# Altium project EEM_PWR_MOD_AC.PrjPCB
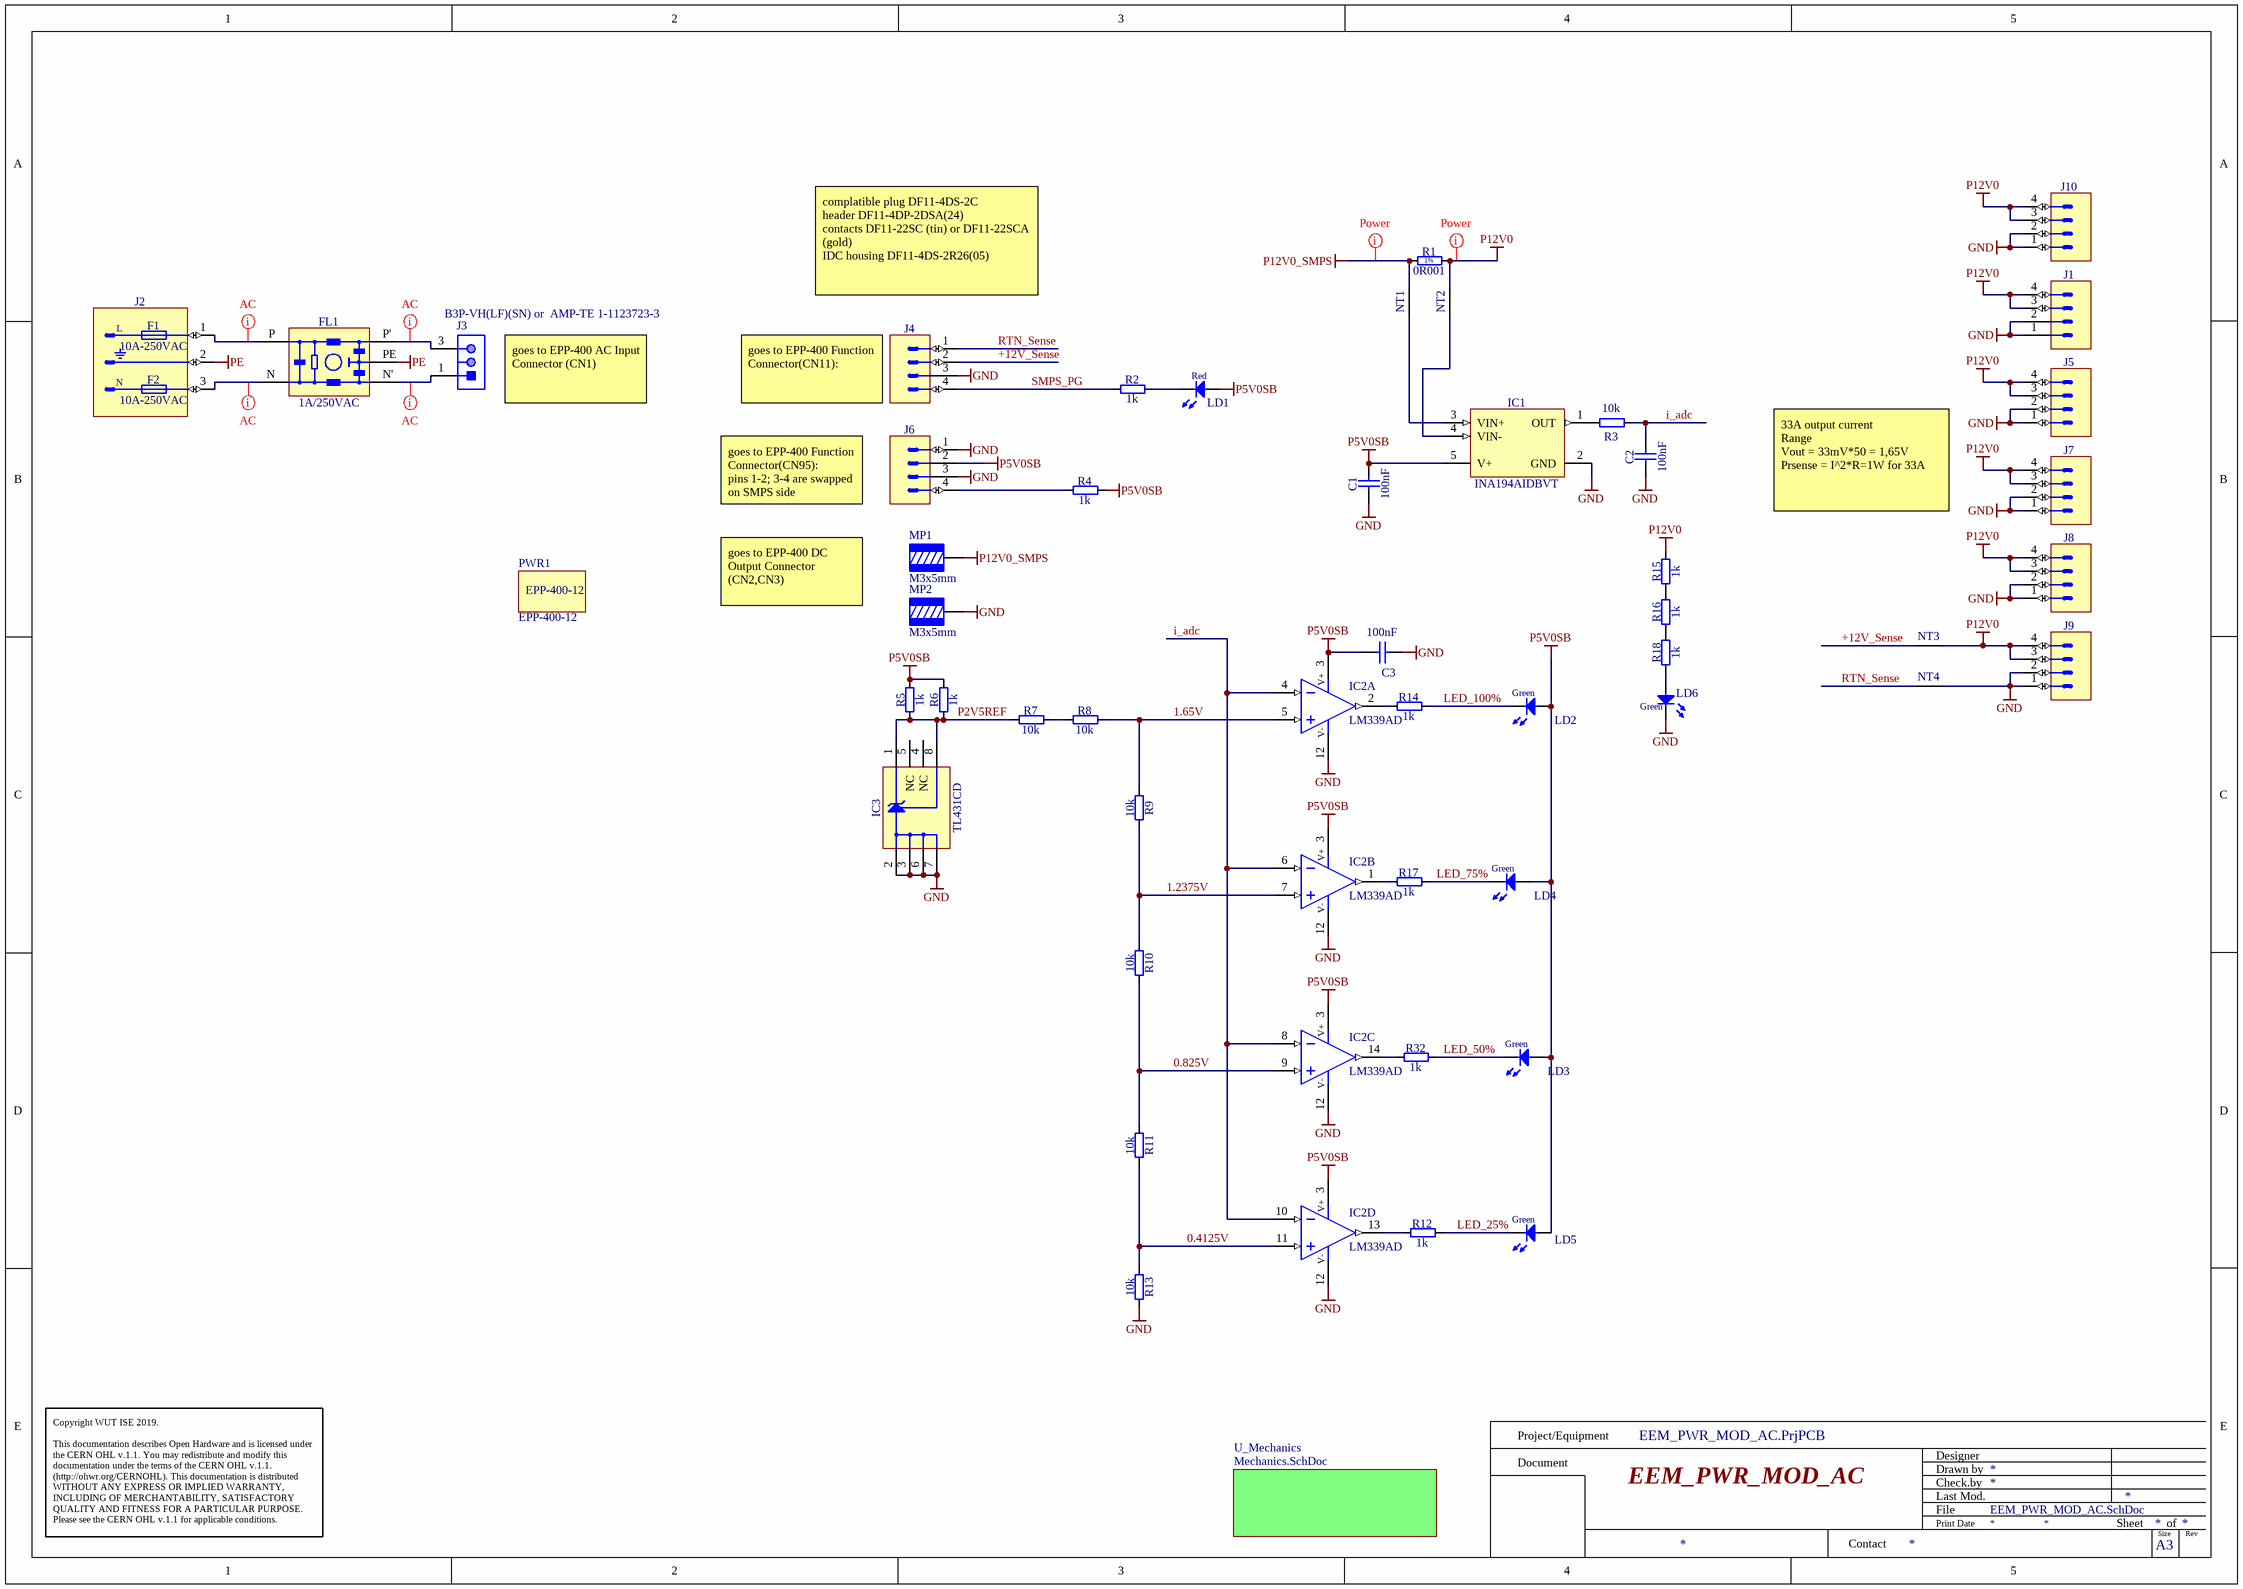
[diagram p0: EEM_PWR_MOD_AC.SchDoc]
P_version: 1.3
2 sheets, 80 parts. Net scope: global (net labels, ports and power ports of the same name join across sheets).
Board file: EEM_PWR_MOD_AC.pcbdoc
Sheets:
  EEM_PWR_MOD_AC.SchDoc
    U_Mechanics = Mechanics.SchDoc

## Sheet EEM_PWR_MOD_AC.SchDoc: EEM_PWR_MOD_AC
size 420 x 297 mm; Revision: 1.3; Title2: 1.3

### Parts
C1  100nF  [CAPC1005X55N]
C2  100nF  [CAPC1005X55N]
C3  100nF  [CAPC1005X55N]
F1  10A-250VAC  [FUSE_5X20_GLASS_v]
F2  10A-250VAC  [FUSE_5X20_GLASS_v]
FL1  1A/250VAC  [FIL_SCHAFFNER_FN 406]
IC1  INA194AIDBVT  [SOT95P280X145-5N]
IC2  LM339AD  [SOIC127P600X175-14N]  (parts A,B,C,D of 4)
IC3  TL431CD  [SOIC127P600X175-8N]
J1  Mini-Fit Jr.™  [MOLEX_39-30-0040]  (value not drawn)
J2  IEC  [SCHURTER_GSF1.2202.31]  (value not drawn)
J3  B3P-VH(LF)(SN) or  AMP-TE 1-1123723-3  [JST-B3P-VH(LF)(SN)-3_V]
J4  Header 4  [HIROSE_DF11-4DP-2DSA]  (value not drawn)
J5  Mini-Fit Jr.™  [MOLEX_39-30-0040]  (value not drawn)
J6  Header 4  [HIROSE_DF11-4DP-2DSA]  (value not drawn)
J7  Mini-Fit Jr.™  [MOLEX_39-30-0040]  (value not drawn)
J8  Mini-Fit Jr.™  [MOLEX_39-30-0040]  (value not drawn)
J9  Mini-Fit Jr.™  [MOLEX_39-30-0040]  (value not drawn)
J10  Mini-Fit Jr.™  [MOLEX_39-30-0040]  (value not drawn)
LD1  Red  [LED_AVAGO_HSMC-C120]
LD2  Green  [LED_AVAGO_HSME-C120]
LD3  Green  [LED_AVAGO_HSME-C120]
LD4  Green  [LED_AVAGO_HSME-C120]
LD5  Green  [LED_AVAGO_HSME-C120]
LD6  Green  [LED_AVAGO_HSME-C120]
MP1  M3x5mm  [7461057_for chemical surfaces]
MP2  M3x5mm  [7461057_for chemical surfaces]
NT1  Net Tie  [Net Tie]  (value not drawn)  (net tie, no BOM)
NT2  Net Tie  [Net Tie]  (value not drawn)  (net tie, no BOM)
NT3  Net Tie  [Net Tie]  (value not drawn)  (net tie, no BOM)
NT4  Net Tie  [Net Tie]  (value not drawn)  (net tie, no BOM)
PWR1  EPP-400-12  [EPP-400-12]
R1  0R001  [RESM11670X254N]
R2  1k  [RESC1608X55N]
R3  10k  [RESC1608X55N]
R4  1k  [RESC1608X55N]
R5  1k  [RESC1608X55N]
R6  1k  [RESC1608X55N]
R7  10k  [RESC1608X55N]
R8  10k  [RESC1608X55N]
R9  10k  [RESC1608X55N]
R10  10k  [RESC1608X55N]
R11  10k  [RESC1608X55N]
R12  1k  [RESC1608X55N]
R13  10k  [RESC1608X55N]
R14  1k  [RESC1608X55N]
R15  1k  [RESC1608X55N]
R16  1k  [RESC1608X55N]
R17  1k  [RESC1608X55N]
R18  1k  [RESC1608X55N]
R32  1k  [RESC1608X55N]

### Sub-sheets
U_Mechanics = Mechanics.SchDoc: no entries

### Nets
GND: C1.1 C2.1 C3.1 IC1.2(GND) IC2.12(V-) IC3.2(A) IC3.3(A) IC3.6(A) IC3.7(A) J1.1 J1.2 J4.3 J5.1 J5.2 J6.1 J6.3 J7.1 J7.2 J8.1 J8.2 J9.1 J9.2 J10.1 J10.2 LD6.1(C) MP2.1 NT4.2 R13.2
P5V0SB: C1.2 C3.2 IC1.5(V+) IC2.3(V+) J6.2 LD1.2(A) LD2.2(A) LD3.2(A) LD4.2(A) LD5.2(A) R4.2 R5.2 R6.2
P12V0: J1.3 J1.4 J5.3 J5.4 J7.3 J7.4 J8.3 J8.4 J9.3 J9.4 J10.3 J10.4 NT2.2 NT3.2 R1.2 R15.2
P12V0_SMPS: MP1.1 NT1.2 R1.1
PE: FL1.PE J2.2
0.825V: IC2.9(IN+) R10.2 R11.1
0.4125V: IC2.11(IN+) R11.2 R13.1
1.65V: IC2.5(IN+) R8.2 R9.1
1.2375V: IC2.7(IN+) R9.2 R10.1
+12V_Sense: J4.2 NT3.1
i_adc: C2.2 IC2.4(IN-) IC2.6(IN-) IC2.8(IN-) IC2.10(IN-) R3.1
LED_25%: LD5.1(C) R12.2
LED_50%: LD3.1(C) R32.2
LED_75%: LD4.1(C) R17.2
LED_100%: LD2.1(C) R14.2
P2V5REF: IC3.1(C) IC3.8(REF) R5.1 R6.1 R7.1
RTN_Sense: J4.1 NT4.1
SMPS_PG: J4.4 R2.1
NetFL1_N: FL1.N J2.3
NetFL1_N': FL1.N' J3.1
NetFL1_P: FL1.P J2.1
NetFL1_P': FL1.P' J3.3
NetIC1_1: IC1.1(OUT) R3.2
NetIC1_3: IC1.3(VIN+) NT1.1
NetIC1_4: IC1.4(VIN-) NT2.1
NetIC2_1: IC2.1(OUT) R17.1
NetIC2_2: IC2.2(OUT) R14.1
NetIC2_13: IC2.13(OUT) R12.1
NetIC2_14: IC2.14(OUT) R32.1
NetJ6_4: J6.4 R4.1
NetLD1_1: LD1.1(C) R2.2
NetLD6_2: LD6.2(A) R18.1
NetR7_2: R7.2 R8.1
NetR15_1: R15.1 R16.2
NetR16_1: R16.1 R18.2

Not connected (* = marked no-connect by the designer): IC3 4(NC) 5(NC)

### Layout directives
net class AC: NetFL1_N, NetFL1_N', NetFL1_P, NetFL1_P'
net class Power: P12V0, P12V0_SMPS

### Notes on the sheet
- complatible plug DF11-4DS-2C
  header DF11-4DP-2DSA(24)
  contacts DF11-22SC (tin) or DF11-22SCA (gold)
  IDC housing DF11-4DS-2R26(05)
- (near J3) goes to EPP-400 AC Input Connector (CN1)
- goes to EPP-400 Function Connector(CN11):
- goes to EPP-400 Function Connector(CN95):
  pins 1-2; 3-4 are swapped on SMPS side
- 33A output current
  Range
  Vout = 33mV*50 = 1,65V
  Prsense = I^2*R=1W for 33A
- goes to EPP-400 DC Output Connector (CN2,CN3)
- Project/Equipment
- Document
- Designer
- Drawn by
- Check.by
- Copyright WUT ISE 2019.
  This documentation describes Open Hardware and is licensed under the CERN OHL v.1.1. You may redistribute and modify this documentation under the terms of the CERN OHL v.1.1. (http://ohwr.org/CERNOHL). This documentation is distributed WITHOUT ANY EXPRESS OR IMPLIED WARRANTY, INCLUDING OF MERCHANTABILITY, SATISFACTORY QUALITY AND FITNESS FOR A PARTICULAR PURPOSE. Please see the CERN OHL v.1.1 for applicable conditions.
- Contact
- File
- Last Mod.
- Print Date
- Sheet
- Size
- A3
- of
- Rev
- (in symbol R4527_0R001_1%_2W_75PPM) 1%
- (in symbol SCHURTER_GSF1.2202.31) L; N

### Library data of the parts
C1-C3 = CC0402_100NF_25V_10%_X7R_YUDEN_TMK105B7104KVHF: Non-polarised capacitor; Part Description: SMD Multilayer Chip Ceramic Capacitor (High Dielectric Type) for Automotive / Industrial Applications; Manufacturer: TAIYO YUDEN; Voltage: 25V; TC: X7R; Tolerance: ±10%; Part Number: CC0402_100NF_25V_10%_X7R_YUDEN_TMK105B7104KVHF; Component Kind: Standard; Component Type: Standard; Pin Count: 2; Value: 100nF; Status: Not Recommended; Manufacturer Part Number: TMK105B7104KVHF; Case: 0402; Mounted: Yes; Socket: No; SMD: Yes; Sense: No; HelpURL: \\cern.ch\dfs\Applications\Altium\Datasheets\CC0402_TAIYO-YUDEN_TMK105B7104KVHF.pdf; Author: CERN DEM JLC; CreateDate: 10/05/2017; LatestRevisionDate: 10/05/2017; ComponentHeight: 0.55mm
F1 F2 = FUSE_SCHURTER_0034.3127_v: Fuse; Part Description: Cylindrical 5x20 mm, Time-Lag T Miniature Fuse, FST Series; PressFit: No; Part Number: FUSE_SCHURTER_0034.3127_v; Component Kind: Accessories; Component Type: Standard; Pin Count: 0; PackageDescription: 5x20mm Cylindrical Fuse, SCHURTER FST5X20 Series; Family: Fuse; Mounted: Yes; Socket: Yes; SMD: No; Sense: No; Value: 10A-250VAC; Manufacturer: SCHURTER; Manufacturer Part Number: 0034.3127; ComponentHeight: 20.5mm; HelpURL: \\cern.ch\dfs\Applications\Altium\Datasheets\FUSE_SCHURTER_FST5X20.pdf; Author: CERN DEM JLC; CreateDate: 28.01.2013; LatestRevisionDate: 28.01.2013; ClassName: Overlapping
FL1 = FIL_SCHAFFNER_FN 406-1-02: 0.6 to 8.4A 230VAC Single Phase Ultra Compact EMC Filter; Part Number: FIL_SCHAFFNER_FN406-3-02; Manufacturer Part Number: FN406-3-02; Component Kind: Standard; Component Type: Standard; Pin Count: 5; Value: 1A/250VAC; Part Description: Single Phase Ultra Compact EMC Filter; Manufacturer: SCHAFFNER; Case: L45 W15 H28; Mounted: Yes; Socket: No; SMD: No; Sense: No; ComponentHeight: 28mm; HelpURL: \\cern.ch\dfs\Applications\Altium\Datasheets\FIL_SCHAFFNER_FN 406-1-02.pdf; Author: CERN DEM JLC; CreateDate: 24.05.2017; LatestRevisionDate: 24.05.2017
IC1 = INA194AIDBVT: Current Shunt Monitor -16V to +80V Common-Mode Range; Manufacturer: TEXAS INSTRUMENTS; PressFit: No; Bonding: No; Part Number: INA194AIDBVT; Component Kind: Standard; Component Type: Standard; Device: INA194AIDBVT; PackageDescription: SOT, 0.95mm pitch; 5 pin, 1.60mm W X 2.90mm L X 1.45mm H body, IPC Medium Density; Part Description: Current Shunt Monitor -16V to +80V Common-Mode Range; Manufacturer Part Number: INA194AIDBVT; Pin Count: 5; Case: SOT23-5; Mounted: Yes; Socket: No; SMD: Yes; Sense: No; ComponentHeight: 1.45mm; Author: CERN DEM JLC; HelpURL: \\cern.ch\dfs\Applications\Altium\Datasheets\INA194AIDBVT.pdf; CreateDate: 10.05.2010; LatestRevisionDate: 10.05.2010
IC2 = LM339AD: Quad Operational Amplifier; Part Description: Quad Differential Comparator; Manufacturer: TEXAS INSTRUMENTS; PressFit: No; Bonding: No; Part Number: LM339AD; Component Kind: Standard; Component Type: Standard; Device: LM339AD; PackageDescription: SOIC 14, Pitch 1.27mm - Body 4x8.75mm, IPC Medium Density; Manufacturer Part Number: LM339AD; Pin Count: 14; Case: SOIC14; Mounted: Yes; Socket: No; SMD: Yes; Sense: No; ComponentHeight: 1.75mm; Author: CERN DEM JLC; HelpURL: \\cern.ch\dfs\Applications\Altium\Datasheets\LM339AD.pdf; CreateDate: 09.03.2011; LatestRevisionDate: 09.03.2011
IC3 = TL431CD: Precision Programmable Reference; Part Description: Vref (2.5V) To 36V 2% Precision Programmable Reference; Manufacturer: TEXAS INSTRUMENTS; PressFit: No; Bonding: No; Part Number: TL431CD; Component Kind: Standard; Component Type: Standard; Device: TL431CD; PackageDescription: SOIC 8, Pitch 1.27mm, Body 4x5mm, IPC Medium Density; Manufacturer Part Number: TL431CD; Pin Count: 8; Case: SOIC8; Mounted: Yes; Socket: No; SMD: Yes; Sense: No; ComponentHeight: 1.75mm; HelpURL: \\cern.ch\dfs\Applications\Altium\Datasheets\TL431CD.pdf; Author: CERN DEM JLC; CreateDate: 18.01.2011; LatestRevisionDate: 28.02.2011
J1 J5 J7-J10 = MOLEX_39-30-0040: Connector 4 Male; Part Description: 4.20mm (.165") Pitch Mini-Fit Jr. Header, Dual Row, Right Angle with Snap-in Plastic Peg PCB Lock, 4 Circuits; Manufacturer: MOLEX; PressFit: No; Part Number: MOLEX_39-30-0040; Component Kind: Standard; Component Type: Standard; Pin Count: 4; Family: Mini-Fit Jr.™; Mounted: Yes; Socket: No; SMD: No; Sense: No; Status: None; Manufacturer Part Number: 39-30-0040; ComponentHeight: 11.4mm; HelpURL: \\cern.ch\dfs\Applications\Altium\Datasheets\MOLEX_39-30-0040.pdf; Author: CERN DEM JLC; CreateDate: 02/10/2018; LatestRevisionDate: 02/10/2018
J2 = SCHURTER_GSF1.2202.31: Connector 3 Male 2P+ 2 Fuse Holder; Part Number: SCHURTER_GSF1.2201.31; Part Description: 10A 250Vac Sandwich Panel Mount (1.5mm) Inlet IEC Connector With 2 Fuseholder 5x20mm And Snap-in PCB Mount; Manufacturer Part Number: GSF1.2201.31; PressFit: No; Component Kind: Standard; Component Type: Standard; Footprint: SCHURTER_GSF1.2201.31; Pin Count: 3; Family: IEC; Mounted: Yes; Socket: No; SMD: No; Sense: No; Status: None; Manufacturer: SCHURTER; ComponentHeight: 24.45mm; HelpURL: \\cern.ch\dfs\Applications\Altium\Datasheets\SCHURTER_GSF1.2202.31.pdf; Author: CERN DEM JMW; CreateDate: 20.09.2012; LatestRevisionDate: 20.09.2012; ClassName: Overlapping
J3 = CMP-1755-00003-1: Male Header, Pitch 3.96 mm, 1 x 3 Position, Height 10.9 mm, Tail Length 3.7 mm, -25 to 85 degC, RoHS, Bulk; PackageReference: B3P-VH(LF)(SN); ComponentLink2Description: Datasheet; ComponentLink2URL: http://www.jst-mfg.com/product/pdf/eng/eVH.pdf; DatasheetVersion: May-16; PackageDescription: Male Header, Pitch 3.96 mm, 1 x 3 Position, Height 10.9 mm, Tail Length 3.7 mm; ComponentLink1URL: http://www.jst.com/home2.html; ComponentLink1Description: Manufacturer URL; Manufacturer Part Number: B3P-VH(LF)(SN)
J4 J6 = CON_4_HIROSE_DF11-4DP-2DSA: Connector 4 Male; Part Description: Pitch 2mm, Dual Row, 4 Contacts,  vertical Header, DF11 Series; Manufacturer: HIROSE (HRS); PressFit: No; Part Number: HIROSE_DF11-4DP-2DSA; Component Kind: Standard; Component Type: Standard; Pin Count: 4; Family: Header 4; Mounted: Yes; Socket: No; SMD: Yes; Sense: No; Status: None; Manufacturer Part Number: DF11-4DP-2DSA; ComponentHeight: 3.6mm; HelpURL: \\cern.ch\dfs\Applications\Altium\Datasheets\HIROSE_DF13-4P-1.25H(50).pdf; Author: GK; CreateDate: 22.10.2014; LatestRevisionDate: 22.10.2014
LD1 = LED_AVAGO_HSMC-C120: LED Red 1C 2A; Part Description: High Performance Right Angle Chip Red LED; Manufacturer: AVAGO TECHNOLOGIES; PressFit: No; Bonding: No; Part Number: LED_AVAGO_HSMC-C120; Component Kind: Standard; Component Type: Standard; Color: Red; PackageDescription: Red Chip LED, 2-Leads, Body 1.7x1.1mm, Side Emitting Package; Manufacturer Part Number: HSMC-C120; Pin Count: 2; Mounted: Yes; Socket: No; SMD: Yes; Sense: No; ComponentHeight: 0.7mm; HelpURL: \\cern.ch\dfs\Applications\Altium\Datasheets\LED_AVAGO_HSMC-C120.pdf; ComponentLink1URL: \\cern.ch\dfs\Applications\Altium\Datasheets\LED_AVAGO_HSMC-C120_DESIGN-GUIDE.pdf; ComponentLink1Description: Design Guide; Author: CERN DEM JMW; CreateDate: 22.07.2009; LatestRevisionDate: 20.06.2012
LD2-LD6 = LED_AVAGO_HSME-C120: LED Green 1C 2A; Part Description: High Performance Right Angle Chip Green LED; Manufacturer: AVAGO TECHNOLOGIES; PressFit: No; Bonding: No; Part Number: LED_AVAGO_HSME-C120; Component Kind: Standard; Component Type: Standard; Color: Green; PackageDescription: Green Chip LED, 2-Leads, Body 1.7x1.1mm, Side Emitting Package; Manufacturer Part Number: HSME-C120; Pin Count: 2; Mounted: Yes; Socket: No; SMD: Yes; Sense: No; ComponentHeight: 0.7mm; HelpURL: \\cern.ch\dfs\Applications\Altium\Datasheets\LED_AVAGO_HSME-C120.pdf; ComponentLink1URL: \\cern.ch\dfs\Applications\Altium\Datasheets\LED_AVAGO_HSME-C110_DESIGN-GUIDE.pdf; ComponentLink1Description: Design Guide; Author: CERN DEM JMW; CreateDate: 22.07.2009; LatestRevisionDate: 20.06.2012
MP1 MP2 = 7461057: WP-BUTR Press-Fit with Internal thread, two rows, 7x7mm, 6 pins, M3x5mm, 100A; Pin Number: 6; Thread Length: 5mm; Thread: M3; Surface: Tin; ComponentLink1Description: Manufacturer; ComponentLink1URL: http://www.we-online.de; ComponentLink2Description: Datasheet; ComponentLink2URL: https://katalog.we-online.com/em/datasheet/7461057.pdf; Operating Temperature: -55 to +150degC; Height: 6mm; Material: Brass; Manufacturer Part Number: 7461057; Packaging: Bulk; Mounting Technology: Press-Fit; Rated Current: 100A; Publisher: Wurth Elektronik; Published Date: September 2019; Size: 7x7mm
NT1-NT4 = Net Tie: Part Description: Net Tie (2 Nets); Mounted: No; Part Number: Net Tie; Component Type: Net Tie; Pin Count: 2; Family: Net Tie; Socket: No; SMD: No; Sense: No; Status: None; ComponentHeight: 0mm; HelpURL: Undefined; Author: CERN DEM JLC; CreateDate: 22.03.2011; LatestRevisionDate: 22.03.2011; PackageDescription: 2 Plated Through Hole For Coaxial Cable Link: Hole Dia.=1.4mm Pad Dia.=2.5mm
PWR1 = EPP-400-12: Switching Power Supplies 399.6W 12V 33.3A 3X5 open frame W/PFC; Manufacturer Part Number: EPP-400-12; ClassName: Overlapping
R1 = R4527_0R001_1%_2W_75PPM: Resistor - 1%; Part Description: Surface Mount Power Metal Strip® Resistor; Manufacturer: VISHAY DALE; Manufacturer Part Number: WSR21L000FEA; Power: 2W; TC: ±75ppm/°C; PressFit: No; Part Number: R4527_0R001_1%_2W_75PPM; Component Kind: Standard; Component Type: Standard; Pin Count: 2; Value: 0R001; Status: None; Tolerance: ±1%; Case: 4527; Mounted: Yes; Sense: No; Socket: No; SMD: Yes; ComponentHeight: 2.53mm; HelpURL: \\cern.ch\dfs\Applications\Altium\Datasheets\R4527_VISHAY_WSR2.pdf; Author: CERN DEM JLC; CreateDate: 22/03/2011; LatestRevisionDate: 22/03/2011
R2 R4-R6 R12 R14-R18 R32 = R0603_1K_1%_0.1W_100PPM: Resistor - 1%; Part Description: General Purpose Thick Film Chip Resistor; Manufacturer: GENERIC; Manufacturer1 Part Number: NRC06F1001TRF; Power: 0.1W; TC: ±100ppm/°C; PressFit: No; Part Number: R0603_1K_1%_0.1W_100PPM; Component Kind: Standard; Component Type: Standard; Pin Count: 2; Value: 1k; Status: Preferred; Tolerance: ±1%; Manufacturer Part Number: R0603_1K_1%_0.1W_100PPM; Case: 0603; Mounted: Yes; Sense: No; Socket: No; SMD: Yes; Manufacturer1 Example: NIC COMPONENT; Manufacturer1 ComponentHeight: 0.55mm; HelpURL: \\cern.ch\dfs\Applications\Altium\Datasheets\R0603_NIC_NRC.pdf; Author: CERN DEM JLC; CreateDate: 03.12.2007; LatestRevisionDate: 13.03.2008
R3 R7-R11 R13 = R0603_10K_1%_0.1W_100PPM: Resistor - 1%; Part Description: General Purpose Thick Film Chip Resistor; Manufacturer: GENERIC; Manufacturer1 Part Number: NRC06F1002TRF; Power: 0.1W; TC: ±100ppm/°C; PressFit: No; Part Number: R0603_10K_1%_0.1W_100PPM; Component Kind: Standard; Component Type: Standard; Pin Count: 2; Value: 10k; Status: Preferred; Tolerance: ±1%; Manufacturer Part Number: R0603_10K_1%_0.1W_100PPM; Case: 0603; Mounted: Yes; Sense: No; Socket: No; SMD: Yes; Manufacturer1 Example: NIC COMPONENT; Manufacturer1 ComponentHeight: 0.55mm; HelpURL: \\cern.ch\dfs\Applications\Altium\Datasheets\R0603_NIC_NRC.pdf; Author: CERN DEM JLC; CreateDate: 03.12.2007; LatestRevisionDate: 13.03.2008

## Sheet Mechanics.SchDoc: EEM_PWR_MOD_AC
size A4; Revision: 1.3; Title2: 1.3
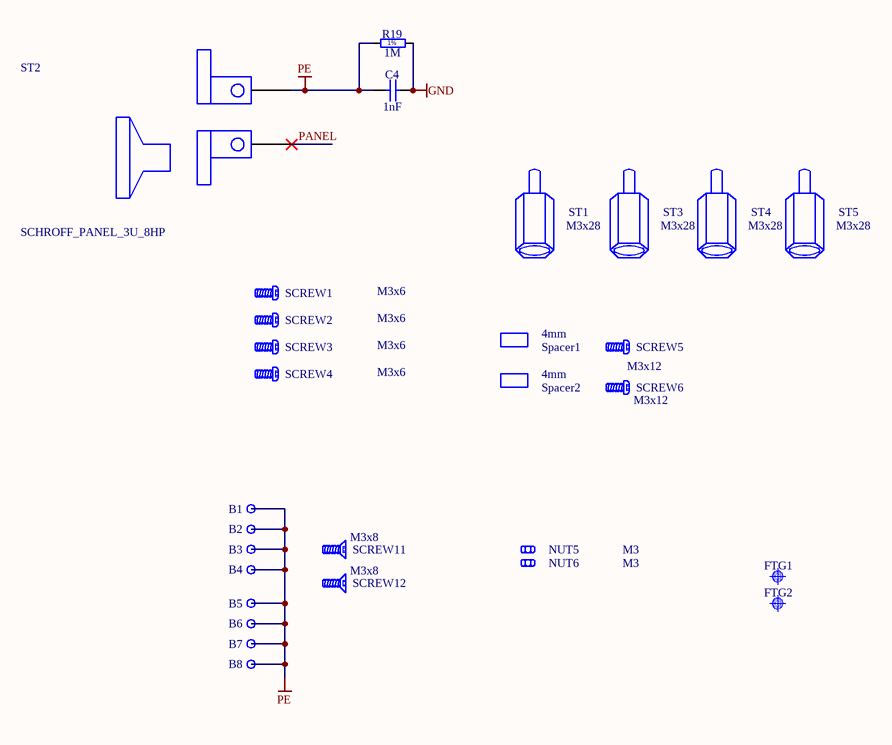
[diagram p1: Mechanics.SchDoc]

### Parts
B1  Plated Hole  [MTG320_700]  (value not drawn)  (no BOM)
B2  Plated Hole  [MTG320_700]  (value not drawn)  (no BOM)
B3  Plated Hole  [MTG320_700]  (value not drawn)  (no BOM)
B4  Plated Hole  [MTG320_700]  (value not drawn)  (no BOM)
B5  Plated Hole  [MTG350_650]  (value not drawn)  (no BOM)
B6  Plated Hole  [MTG350_650]  (value not drawn)  (no BOM)
B7  Plated Hole  [MTG350_650]  (value not drawn)  (no BOM)
B8  Plated Hole  [MTG350_650]  (value not drawn)  (no BOM)
C4  1nF  [CAPC3216X180N]
FTG1  Use only in PCB  [FIDUCIAL_TOP_C100-200]  (value not drawn)
FTG2  Use only in PCB  [FIDUCIAL_TOP_S100-200]  (value not drawn)
NUT5  M3  [BOSSARD_BN628-1241443_v]
NUT6  M3  [BOSSARD_BN628-1241443_v]
R19  1M  [RESC3216X65N]
SCREW1  M3x6  [BOSSARD_BN5687-3061605_v]
SCREW2  M3x6  [BOSSARD_BN5687-3061605_v]
SCREW3  M3x6  [BOSSARD_BN5687-3061605_v]
SCREW4  M3x6  [BOSSARD_BN5687-3061605_v]
SCREW5  M3x12  [BOSSARD_BN5687-3061609_v]
SCREW6  M3x12  [BOSSARD_BN5687-3061609_v]
SCREW11  M3x8  [OSSARD_M3X8/BN3327_h]
SCREW12  M3x8  [OSSARD_M3X8/BN3327_h]
Spacer1  4mm  [DREMEC_DR316/3.2X4]
Spacer2  4mm  [DREMEC_DR316/3.2X4]
ST1  M3x28  [Ettinger-M3X28_05.13.281_rev]
ST2  SCHROFF_PANEL_3U_8HP  [Schroff 30848430]
ST3  M3x28  [Ettinger-M3X28_05.13.281_rev]
ST4  M3x28  [Ettinger-M3X28_05.13.281_rev]
ST5  M3x28  [Ettinger-M3X28_05.13.281_rev]

### Nets
GND: C4.2 R19.2
PE: B1.1 B2.1 B3.1 B4.1 B5.1 B6.1 B7.1 B8.1 C4.1 R19.1 ST2.1
PANEL: ST2.2

### Notes on the sheet
- (in symbol R1206_1M_1%_0.25W_100PPM) 1%

### Library data of the parts
B1-B4 = PLATED_HOLE3.2_PAD7.0: Single Terminal Socket; Part Description: Plated Through Hole: Hole Dia.=3.2mm Pad Dia.=7.0mm; Mounted: No; Part Number: PLATED_HOLE3.2_PAD7.0; Component Type: Standard (No BOM); Pin Count: 1; Family: Plated Hole; Socket: No; SMD: No; Sense: No; Status: None; ComponentHeight: 0mm; HelpURL: Undefined; Author: CERN DEM JMW; CreateDate: 28.11.2017; LatestRevisionDate: 28.11.2017; PackageDescription: Plated Through Hole: Hole Dia.=3.2mm Pad Dia.=7.0mm; ClassName: Overlapping
B5-B8 = PLATED_HOLE3.5_PAD6.5: Single Terminal Socket; Part Description: Plated Through Hole: Hole Dia.=3.5mm Pad Dia.=6.5mm; Mounted: No; Part Number: PLATED_HOLE3.5_PAD6.5; Component Type: Standard (No BOM); Pin Count: 1; Family: Plated Hole; Socket: No; SMD: No; Sense: No; Status: None; ComponentHeight: 0mm; HelpURL: Undefined; Author: CERN DEM JLC; CreateDate: 20.11.2008; LatestRevisionDate: 23.11.2011; PackageDescription: Plated Through Hole: Hole Dia.=3.5mm Pad Dia.=6.5mm; ClassName: Overlapping
C4 = CC1206_1NF_2KV_10%_X7R: Non-polarised capacitor; Part Description: High Voltage MLC Chip Capacitor; Manufacturer: GENERIC; Manufacturer1 Part Number: 1206GC102KAT2A; Voltage: 2kV; TC: X7R; Tolerance: ±10%; Part Number: CC1206_1NF_2KV_10%_X7R; Component Kind: Standard; Component Type: Standard; Pin Count: 2; Value: 1nF; Status: None; Manufacturer Part Number: CC1206_1NF_2KV_10%_X7R; Case: 1206; Mounted: Yes; Socket: No; SMD: Yes; Sense: No; Manufacturer1 Example: AVX; Manufacturer1 ComponentHeight: 1.8mm; HelpURL: \\cern.ch\dfs\Applications\Altium\Datasheets\CC1206_X7R_AVX_HV-MLC.pdf; Author: CERN DEM JLC; CreateDate: 19.11.2012; LatestRevisionDate: 17.05.2017
FTG1 = FIDUCIAL_TARGET_C100-200: Fiducial Target; Part Description: Round Fiducial Target, Top Layer, 1.0mm, Top Solder 2.0mm, Keepout =2.0mm; Mounted: No; Part Number: FIDUCIAL_TARGET_C100-200; Component Kind: Standard (No BOM); Component Type: Standard (No BOM); Pin Count: 1; Family: Fiducial; Socket: No; SMD: Yes; Sense: No; Status: None; ComponentHeight: 0mm; HelpURL: Undefined; Author: CERN DEM JLC; CreateDate: 09.02.2010; LatestRevisionDate: 04.04.2012; PackageDescription: Round Fiducial Target, Top Layer, 1.0mm, Top Solder 2.0mm, Keepout =2.0mm
FTG2 = FIDUCIAL_TARGET_S100-200: Fiducial Target; Part Description: Square Fiducial Target, Top Layer, 1.0mm, Top Solder 2.0mm, Keepout =2.0mm; Mounted: No; Part Number: FIDUCIAL_TARGET_S100-200; Component Kind: Standard (No BOM); Component Type: Standard (No BOM); Pin Count: 1; Family: Fiducial; Socket: No; SMD: Yes; Sense: No; Status: None; ComponentHeight: 0mm; HelpURL: Undefined; Author: CERN DEM JLC; CreateDate: 09.02.2010; LatestRevisionDate: 04.04.2012; PackageDescription: Square Fiducial Target, Top Layer, 1.0mm, Top Solder 2.0mm, Keepout =2.0mm
NUT5 NUT6 = BOSSARD_BN628-1241443_v: Nut; Part Description: M3 Hexagon Nut ~0,8d, ISO 4032, DIN 934, Stainless Steel A2; Manufacturer Part Number: BN628 Art.1241443; PressFit: No; Part Number: BOSSARD_BN628-1241443_v; Component Kind: Standard; Component Type: Mechanical; Pin Count: 0; PackageDescription: M3 Hexagon Nut ~0,8d, ISO 4032, DIN 934, Stainless Steel A2; Mounted: Yes; Socket: No; SMD: No; Sense: No; Status: None; Value: M3; Manufacturer: BOSSARD; ComponentHeight: 2.4mm; HelpURL: \\cern.ch\dfs\Applications\Altium\Datasheets\BOSSARD_BN628-1241443.pdf; Author: CERN DEM JMW; CreateDate: 04/12/2015; LatestRevisionDate: 04/12/2015; ClassName: Overlapping
R19 = R1206_1M_1%_0.25W_100PPM: Resistor - 1%; Part Description: General Purpose Thick Film Chip Resistor; Manufacturer: GENERIC; Manufacturer1 Part Number: NRC12F1004TRF; Power: 0.25W; TC: ±100ppm/°C; PressFit: No; Part Number: R1206_1M_1%_0.25W_100PPM; Component Kind: Standard; Component Type: Standard; Pin Count: 2; Value: 1M; Status: Preferred; Tolerance: ±1%; Manufacturer Part Number: R1206_1M_1%_0.25W_100PPM; Case: 1206; Mounted: Yes; Sense: No; Socket: No; SMD: Yes; Manufacturer1 Example: NIC COMPONENT; Manufacturer1 ComponentHeight: 0.65mm; HelpURL: \\cern.ch\dfs\Applications\Altium\Datasheets\R1206_NIC_NRC.pdf; Author: CERN DEM JLC; CreateDate: 03.12.2007; LatestRevisionDate: 13.03.2008
SCREW1-SCREW4 = BOSSARD_BN5687-3061605_v: Screw; Part Description: M3 L=6mm Hexalobular Socket Pan Head Screw, Fully Threaded, Stainless Steel A2; Manufacturer Part Number: BN5687 Art.3061605; PressFit: No; Part Number: BOSSARD_BN5687-3061605_v; Component Kind: Standard; Component Type: Mechanical; Pin Count: 0; PackageDescription: M3 L=6mm Hexalobular Socket Pan Head Screw, Fully Threaded - Stainless Steel A2; Mounted: Yes; Socket: No; SMD: No; Sense: No; Status: None; Value: M3x6; Manufacturer: BOSSARD; ComponentHeight: 2.4mm; HelpURL: \\cern.ch\dfs\Applications\Altium\Datasheets\BOSSARD_BN5687-3061605.pdf; Author: CERN DEM JLC; CreateDate: 15/01/2013; LatestRevisionDate: 15/01/2013
SCREW5 SCREW6 = BOSSARD_BN5687-3061609_v: Screw; Part Description: M3 L=12mm Hexalobular Socket Pan Head Screw, Fully Threaded, Stainless Steel A2; Manufacturer Part Number: BN5687 Art.3061609; PressFit: No; Part Number: BOSSARD_BN5687-3061609_v; Component Kind: Standard; Component Type: Mechanical; Pin Count: 0; PackageDescription: M3 L=12mm Hexalobular Socket Pan Head Screw, Fully Threaded - Stainless Steel A2; Mounted: Yes; Socket: No; SMD: No; Sense: No; Status: None; Value: M3x12; Manufacturer: BOSSARD; ComponentHeight: 14.4mm; HelpURL: \\cern.ch\dfs\Applications\Altium\Datasheets\BOSSARD_BN5687-3061609.pdf; Author: CERN DEM JLC; CreateDate: 22/08/2013; LatestRevisionDate: 22/08/2013; ClassName: Overlapping
SCREW11 SCREW12 = Screw_M3x8_Countersunk: Screw; 3x8; Head: countersunk; Pozidriv; A2 stainless steel; Part Number: OSSARD_M3X8/BN3327; Part Description: M3 L=8mm  countersunk; Pozidriv Pan Head Screw, Fully Threaded, Stainless Steel A2; Manufacturer: BOSSARD; Manufacturer Part Number: M3X8/BN3327_h; PressFit: No; Component Kind: Standard; Component Type: Mechanical; Pin Count: 0; PackageDescription: M3 L=8mm Countersunk Posidriv Screw, Fully Threaded - Stainless Steel A2; Mounted: Yes; Socket: No; SMD: No; Sense: No; Status: None; Value: M3x8; ComponentHeight: 5.6mm; HelpURL: \\cern.ch\dfs\Applications\Altium\Datasheets\BOSSARD_BN5687-3061605.pdf; Author: GK; CreateDate: 15/01/2013; LatestRevisionDate: 15/01/2013; ClassName: Overlapping
Spacer1 Spacer2 = MECH_Spacer_3.2x4x6: Metric Female Unthreaded Round Brass Spacer/Pillar, Length 4mm, External Dia. 6mm, Internal Dia. 3.2mm; Manufacturer: DREMEC; Manufacturer Part Number: DR316/3.2X4; Part Number: DREMEC_DR316/3.2X4; Component Kind: Standard; Component Type: Standard; Pin Count: 0; PackageDescription: Metric Female Unthreaded Round Brass Spacer/Pillar, Length 4mm, External Dia. 6mm, Internal Dia. 3.2mm; Mounted: Yes; Socket: No; SMD: No; PressFit: Yes; Sense: No; Status: None; Value: 4mm; Part Description: Metric Female Unthreaded Round Brass Spacer/Pillar, Length 4mm, External Dia. 6mm, Internal Dia. 3.2mm; ComponentHeight: 6mm; HelpURL: \\cern.ch\dfs\Applications\Altium\Datasheets\HARWIN_R6162-02.pdf; Author: GK; CreateDate: 13.09.2017; LatestRevisionDate: 13.09.2017; ClassName: Overlapping
ST1 ST3-ST5 = MECH_Standoff_M3x28_rev: M3x28 standoff; Part Number: Ettinger_05.13.281; Part Description: M3x28 male - female Hex Spacer made of free-machining brass with nickel plated finish; Manufacturer: Ettinger; PressFit: No; Component Kind: Standard; Component Type: Mechanical; Footprint: Ettinger-M3X28_05.13.281; Pin Count: 0; PackageDescription: M3 L=28mm   Fully Threaded - Stainless Steel spacer; Mounted: Yes; Socket: No; SMD: No; Sense: No; Status: None; Value: M3x28; Manufacturer Part Number: 05.13.281; ComponentHeight: 28; HelpURL: \\cern.ch\dfs\Applications\Altium\Datasheets\BOSSARD_BN5687-3061597.pdf; Author: GK; CreateDate: 25.02.2019; LatestRevisionDate: 25.02.2019; ClassName: Overlapping
ST2 = SCHROFF_PANEL_3U_8HP: Schroff 8HP 4U EUROCARD Panel with ejector; Manufacturer Part Number: 30848430

## Nets that join several sheets
GND: EEM_PWR_MOD_AC (28 pins), Mechanics (C4.2 R19.2)
PE: EEM_PWR_MOD_AC (FL1.PE J2.2), Mechanics (11 pins)

## Assembly variants
No_mechanics: not fitted B1 B2 B3 B4 B5 B6 B7 B8 NUT5 NUT6 SCREW1 SCREW2 SCREW3 SCREW4 SCREW5 SCREW6 SCREW11 SCREW12 Spacer1 Spacer2 ST1 ST2 ST3 ST4 ST5